# Altium project PCB_Project.PrjPcb (part 1 of 2)
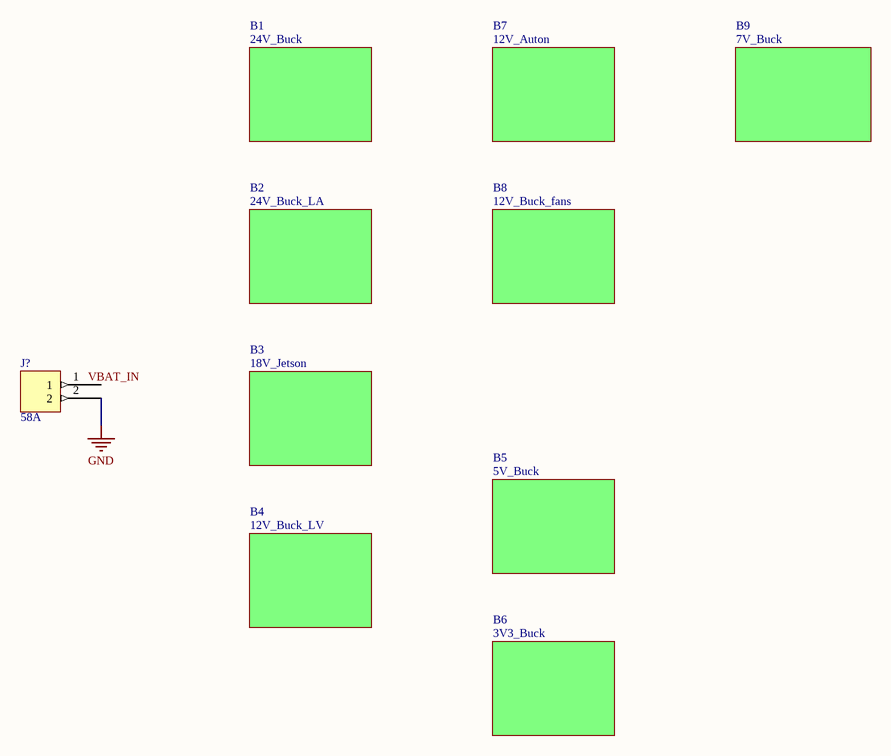
[diagram p0: pdb26.SchDoc]
9 sheets, 286 parts. Net scope: flat (ports and power ports of the same name join across sheets).
Sheets:
  pdb26.SchDoc
    B2 = 24V_Buck_LA.SchDoc
    B3 = 18V_Jetson.SchDoc
    B5 = 5V_Buck.SchDoc
    B6 = 3V3_Buck.SchDoc
    B7 = 12V_Auton.SchDoc
    B8 = 12V_Buck_fans.SchDoc
    B9 = 7V_Buck.SchDoc
  MCU.SchDoc

## Sheet pdb26.SchDoc
size A; SheetNumber: 1; SheetTotal: 9

### Parts
(Parts that share a designator on the sheet are numbered #1, #2 ... from top to bottom, then left to right.)
J?#1  Current Rating: 58A  [CONN-2PIN-0001]  (hidden comment: *691256610002)

### Sub-sheets
B1 = 24V_Buck (file not in this document): no entries
B2 = 24V_Buck_LA: no entries
B3 = 18V_Jetson: no entries
B4 = 12V_Buck_LV (file not in this document): no entries
B5 = 5V_Buck: no entries
B6 = 3V3_Buck: no entries
B7 = 12V_Auton: no entries
B8 = 12V_Buck_fans: no entries
B9 = 7V_Buck: no entries

### Nets
GND: J?#1.2

Not connected (* = marked no-connect by the designer): J?#1 1

### Notes on the sheet
- Labels drawn without touching a wire or pin: VBAT_IN

### Library data of the parts
J?#1 = CONN-2PIN-0001: 2 Position Wire to Board Terminal Block Horizontal with Board 0.400" (10.16mm) Through Hole; Number of Inputs: 2

## Sheet 24V_Buck_LA.SchDoc
size A; SheetNumber: 3; SheetTotal: 15
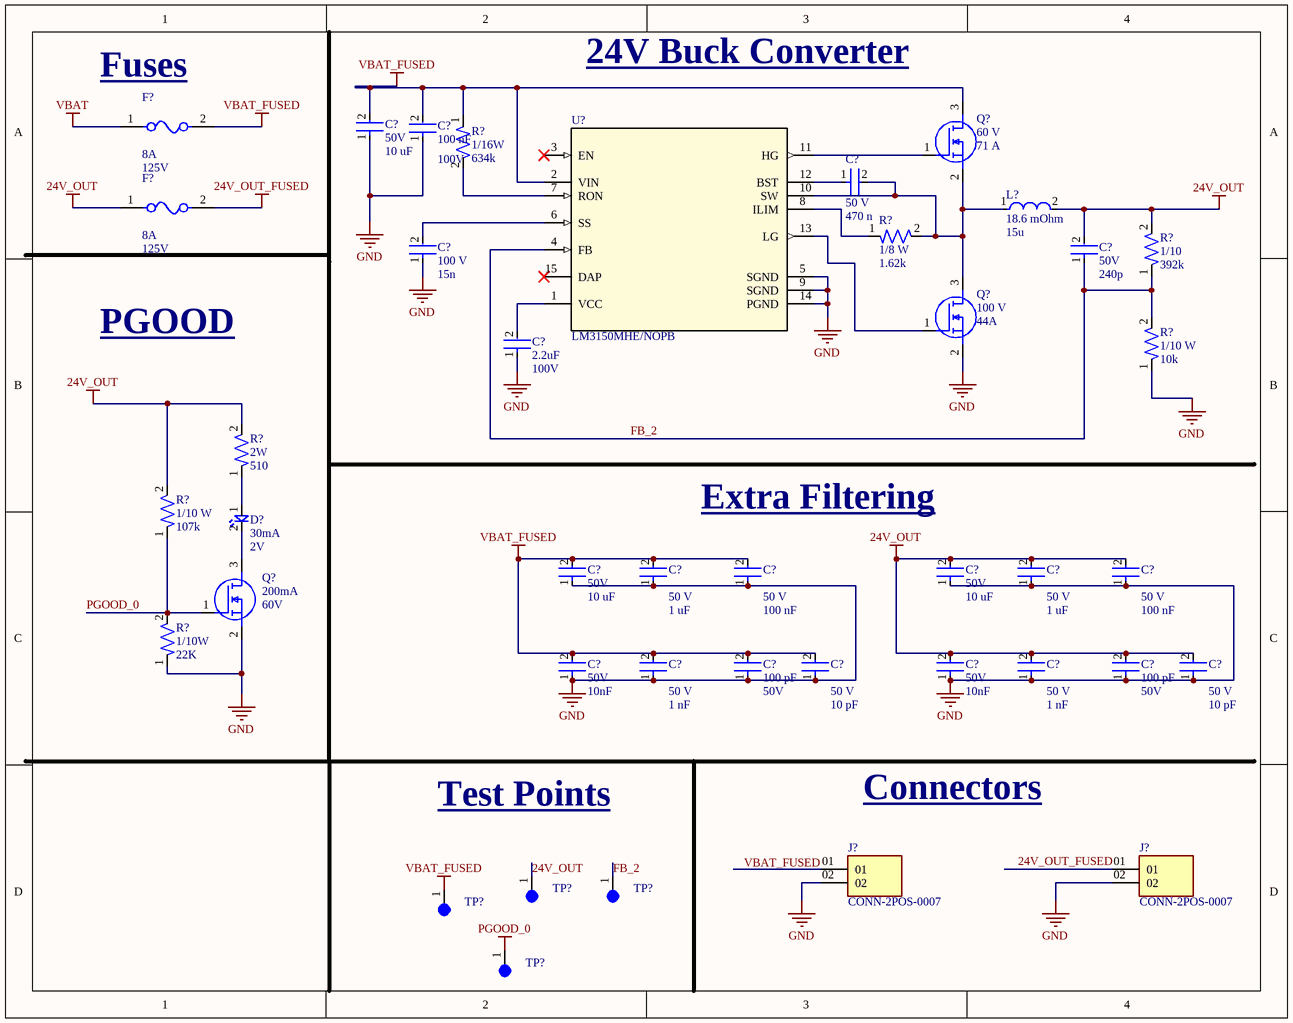
[diagram p1: 24V_Buck_LA.SchDoc]

### Parts
(Parts that share a designator on the sheet are numbered #1, #2 ... from top to bottom, then left to right.)
C?#1  Capacitance: 100 nF  Voltage: 100V  [CAP-0603]  (hidden comment: GMC10X7S104K100NT)
C?#2  Voltage: 50V  Capacitance: 10 uF  [CAP-1210]  (hidden comment: CL32B106KBJNNNE)
C?#3  Voltage: 50 V  Capacitance: 470 n  [CAP-0805]  (hidden comment: CC0805ZRY5V9BB474)
C?#4  Voltage: 100 V  Capacitance: 15n  [CAP-0805]  (hidden comment: CC0805KRX7R0BB153)
C?#5  Voltage: 50V  Capacitance: 240p  [CAP-0402]  (hidden comment: CC0402FRNPO9BN241)
C?#6  Capacitance: 2.2uF  Voltage: 100V  [CAP-1206]  (hidden comment: CC1206KKX7R0BB225)
C?#7  Voltage: 50 V  Capacitance: 1 uF  [CAP-0805]  (hidden comment: CC0805KKX7R9BB105)
C?#8  Voltage: 50 V  Capacitance: 100 nF  [CAP-0805]  (hidden comment: CC0805KRX7R9BB104)
C?#9  Voltage: 50 V  Capacitance: 1 uF  [CAP-0805]  (hidden comment: CC0805KKX7R9BB105)
C?#10  Voltage: 50 V  Capacitance: 100 nF  [CAP-0805]  (hidden comment: CC0805KRX7R9BB104)
C?#11  Voltage: 50V  Capacitance: 10 uF  [CAP-1210]  (hidden comment: CL32B106KBJNNNE)
C?#12  Voltage: 50V  Capacitance: 10 uF  [CAP-1210]  (hidden comment: CL32B106KBJNNNE)
C?#13  Voltage: 50 V  Capacitance: 1 nF  [CAP-0402]  (hidden comment: CC0402KRX7R9BB102)
C?#14  Voltage: 50 V  Capacitance: 10 pF  [CAP-0402]  (hidden comment: CC0402JRNPO9BN100)
C?#15  Voltage: 50 V  Capacitance: 1 nF  [CAP-0402]  (hidden comment: CC0402KRX7R9BB102)
C?#16  Voltage: 50 V  Capacitance: 10 pF  [CAP-0402]  (hidden comment: CC0402JRNPO9BN100)
C?#17  Voltage: 50V  Capacitance: 10nF  [CAP-0805]  (hidden comment: GRM2195C1H103JA01D)
C?#18  Capacitance: 100 pF  Voltage: 50V  [CAP-0402]  (hidden comment: CC0402JRNPO9BN101)
C?#19  Voltage: 50V  Capacitance: 10nF  [CAP-0805]  (hidden comment: GRM2195C1H103JA01D)
C?#20  Capacitance: 100 pF  Voltage: 50V  [CAP-0402]  (hidden comment: CC0402JRNPO9BN101)
D?  Forward Current: 30mA  Forward Voltage: 2V  [LED-0603]  (hidden comment: BL-HKC36G-AV-TRB)
F?#1  Fuse Current: 8A  Voltage Rating: 125V  [FUSE-0001]  (hidden comment: 01550900M)
F?#2  Fuse Current: 8A  Voltage Rating: 125V  [FUSE-0001]  (hidden comment: 01550900M)
J?#2  CONN-2POS-0007  [SAMTEC_HFWJ-02-02-T-S]
J?#3  CONN-2POS-0007  [SAMTEC_HFWJ-02-02-T-S]
L?#1  Resistance: 18.6 mOhm  Inductor: 15u  [IND_XAL1010_COC]  (hidden comment: XAL1010-153MED)
Q?#1  Max Voltage: 60 V  Max Current: 71 A  [NTMFS5C670NLT1G_ONS]  (hidden comment: NTMFS5C670NLT1G)
Q?#2  Voltage Max: 100 V  Current Max: 44A  [TRANS_CSD19534Q5A]  (hidden comment: CSD19534Q5A)
Q?#3  Continuous Current: 200mA  Voltage: 60V  [IC-SOT23-3]  (hidden comment: T2N7002AK,LM)
R?#1  Power: 1/16W  Resistance: 634k  [RES-0603]  (hidden comment: RC0402FR-07634KL)
R?#2  Power: 1/8 W  Resistance: 1.62k  [RES-0805]  (hidden comment: RC0805FR-071K62L)
R?#3  Power: 1/10  Resistance: 392k  [RES-0603]  (hidden comment: RC0603FR-07392KL)
R?#4  Power: 1/10 W  Resistance: 10k  [CAP-0603]  (hidden comment: RC0603FR-0710KL)
R?#5  Power: 2W  Resistance: 510  [RES-2512]  (hidden comment: RC2512JK-7W510RL)
R?#6  Power: 1/10 W  Resistance: 107k  [RES-0603]  (hidden comment: RC0603FR-07107KL)
R?#7  Power: 1/10W  Resistance: 22K  [RES-0603]  (hidden comment: RC0603FR-0722KL)
TP?#1  5003  [TEST-POINT-0001]  (value not drawn)
TP?#2  5003  [TEST-POINT-0001]  (value not drawn)
TP?#3  5003  [TEST-POINT-0001]  (value not drawn)
TP?#4  5003  [TEST-POINT-0001]  (value not drawn)
U?#1  LM3150MHE/NOPB  [MXA14A]

### Nets
24V_OUT: C?#5.2 C?#9.2 C?#10.2 C?#12.2 C?#15.2 C?#16.2 C?#19.2 C?#20.2 F?#2.1 L?#1.2 R?#3.2 R?#5.2 R?#6.2 TP?#1.1
24V_OUT_FUSED: F?#2.2 J?#3.01
GND: C?#1.1 C?#2.1 C?#4.1 C?#6.1 C?#7.1 C?#8.1 C?#9.1 C?#10.1 C?#11.1 C?#12.1 C?#13.1 C?#14.1 C?#15.1 C?#16.1 C?#17.1 C?#18.1 C?#19.1 C?#20.1 J?#2.02 J?#3.02 Q?#2.2(S) Q?#3.2(S) R?#4.1 R?#7.1 U?#1.5(SGND) U?#1.9(SGND) U?#1.14(PGND)
PGOOD_0: Q?#3.1(G) R?#6.1 R?#7.2 TP?#4.1
VBAT: F?#1.1
VBAT_FUSED: C?#1.2 C?#2.2 C?#7.2 C?#8.2 C?#11.2 C?#13.2 C?#14.2 C?#17.2 C?#18.2 F?#1.2 Q?#1.3(D) R?#1.1 TP?#3.1 U?#1.2(VIN)
FB_2: C?#5.1 R?#3.1 R?#4.2 TP?#2.1 U?#1.4(FB)
NetC?#3_1: C?#3.1 U?#1.12(BST)
NetC?#3_2: C?#3.2 L?#1.1 Q?#1.2(S) Q?#2.3(D) R?#2.2 U?#1.10(SW)
NetC?#4_2: C?#4.2 U?#1.6(SS)
NetC?#6_2: C?#6.2 U?#1.1(VCC)
NetD?_1: D?.1 R?#5.1
NetD?_2: D?.2 Q?#3.3(D)
NetQ?#1_1: Q?#1.1(G) U?#1.11(HG)
NetQ?#2_1: Q?#2.1(G) U?#1.13(LG)
NetR?#1_2: R?#1.2 U?#1.7(RON)
NetR?#2_1: R?#2.1 U?#1.8(ILIM)

Not connected (* = marked no-connect by the designer): J?#2 01; U?#1 3(EN)* 15(DAP)*

### Notes on the sheet
- (near F?#1) Fuses
- (near Q?#1) 24V Buck Converter
- PGOOD
- (near C?#8) Extra Filtering
- Test Points
- Connectors
- Labels drawn without touching a wire or pin: VBAT_FUSED

### Library data of the parts
C?#1 = CAP-100N-0001: 0.1 µF ±10% 100V Ceramic Capacitor X7S 0603 (1608 Metric)
C?#2 C?#11 C?#12 = CAP-10U-0002: CAP CER 10UF 50V X7R 1210; Device Class: Ceramic; Size: 1210; ComponentLink1Description: Datasheet; ComponentLink1URL: https://mm.digikey.com/Volume0/opasdata/d220001/medias/docus/41/CL32B106KBJNNNE_Spec.pdf
C?#3 = CAP-470N-0002: 0.47 µF -20%, +80% 50V Ceramic Capacitor Y5V (F) 0805 (2012 Metric)
C?#4 = CAP-15N-0001: 0.015 µF ±10% 100V Ceramic Capacitor X7R 0805 (2012 Metric)
C?#5 = CAP-240P-0001: 240 pF ±1% 50V Ceramic Capacitor C0G, NP0 0402 (1005 Metric)
C?#6 = CAP-2.2U-0001: CAP CER 2.2UF 100V X7R 1206; Device Class: Ceramic; Size: 1206; ComponentLink1Description: Datasheet; ComponentLink1URL: https://www.yageo.com/upload/media/product/productsearch/datasheet/mlcc/UPY-GPHC_X7R_6.3V-to-250V_24.pdf
C?#7 C?#9 = CAP-1U-0001: 1 µF ±10% 50V Ceramic Capacitor X7R 0805 (2012 Metric)
C?#8 C?#10 = CAP-100N-0002: 0.1 µF ±10% 50V Ceramic Capacitor X7R 0805 (2012 Metric)
C?#13 C?#15 = CAP-1N-0001: 1000 pF ±10% 50V Ceramic Capacitor X7R 0402 (1005 Metric)
C?#14 C?#16 = CAP-10P-0001: 10 pF ±5% 50V Ceramic Capacitor C0G, NP0 0402 (1005 Metric)
C?#17 C?#19 = CAP-10N-0001: CAP CER 10000PF 50V C0G/NP0 0805; Device Class: Ceramic; Size: 0805; ComponentLink1Description: Datasheet; ComponentLink1URL: https://search.murata.co.jp/Ceramy/image/img/A01X/G101/ENG/GRM2195C1H103JA01-01.pdf
C?#18 C?#20 = CAP-100P-0001: CAP CER 100PF 50V C0G/NPO 0402; Device Class: Ceramic; Size: 0402; ComponentLink1Description: Datasheet; ComponentLink1URL: https://www.yageo.com/upload/media/product/productsearch/datasheet/mlcc/UPY-GP_NP0_16V-to-50V_18.pdf
D? = LED-0001: LED YELLOW CLEAR 0603 SMD; ComponentLink1Description: Datasheet; ComponentLink1URL: https://www.americanbrightled.com/pdffiles/led-components/smt/BL-HKC36G-AV-TRB.pdf
F?#1 F?#2 = FUSE-0001: FUSE BLOK CARTRIDGE 125V 10A SMD; ComponentLink2Description: Datasheet; ComponentLink2URL: https://www.littelfuse.com/~/media/electronics/datasheets/fuses/littelfuse_fuse_154_154t_154l_154tl_datasheet.pdf.pdf
J?#2 J?#3 = CONN-2POS-0007: Conn Unshrouded Header HDR 2 POS 3.96mm Solder ST Thru-Hole Bulk; MF: Samtec; MP: HFWJ-02-02-T-S; SnapEDA_Link: https://www.snapeda.com/parts/HFWJ-02-02-T-S/Samtec/view-part/?ref=snap; Package: None; Value: *; Check_prices: https://www.snapeda.com/parts/HFWJ-02-02-T-S/Samtec/view-part/?ref=eda
L?#1 = IND-15u-0001: 15 µH Shielded Molded Inductor 9.9 A 18.6mOhm Max Nonstandard; Manufacturer_Name: Coilcraft; Copyright: Copyright (C) 2025 Ultra Librarian. All rights reserved.; Manufacturer_Part_Number: XAL1010-153MED
Q?#1 = NMOS-71A-0001: N-Channel 60 V 17A (Ta), 71A (Tc) 3.6W (Ta), 61W (Tc) Surface Mount 5-DFN (5x6) (8-SOFL); Manufacturer_Name: onsemi; Copyright: Copyright (C) 2025 Ultra Librarian. All rights reserved.; Manufacturer_Part_Number: NTMFS5C670NLT1G; RefDes: RefDes; Type: Type
Q?#2 = NMOS-44A-0001: N-Channel 100 V 44A (Tc) 3.2W (Ta), 63W (Tc) Surface Mount 8-VSONP (5x6); MF: Texas Instruments; Mouser-Purchase-URL: https://snapeda.com/shop?store=Mouser&id=485742; Package: VSONP-8 Texas Instruments; Texas_Instruments-Purchase-URL: https://snapeda.com/shop?store=Texas+Instruments&id=485742; Value: *; Price: None; DigiKey-Purchase-URL: https://snapeda.com/shop?store=DigiKey&id=485742; MP: CSD19534Q5A; SnapEDA_Link: https://www.snapeda.com/parts/CSD19534Q5A/Texas%20Instruments/view-part/485742/?ref=snap; Availability: Good
Q?#3 = NMOS-200MA-0001: MOSFET N-CH 60V 200MA SOT23; ComponentLink1Description: Datasheet; ComponentLink1URL: https://toshiba.semicon-storage.com/info/T2N7002AK_datasheet_en_20150401.pdf?did=29712&prodName=T2N7002AK
R?#1 = RES-634k-0001: RES 634K OHM 1% 1/16W 0402; Tolerance: 1%; Size: 0603; ComponentLink1Description: Datasheet; ComponentLink1URL: https://www.yageo.com/upload/media/product/products/datasheet/rchip/PYu-RC_Group_51_RoHS_L_12.pdf
R?#2 = RES-1.62k-001: 1.62 kOhms ±1% 0.125W, 1/8W Chip Resistor 0805 (2012 Metric) Moisture Resistant Thick Film
R?#3 = RES-392k-0001: 392 kOhms ±1% 0.1W, 1/10W Chip Resistor 0603 (1608 Metric) Moisture Resistant Thick Film
R?#4 = RES-10k-0002: 10 kOhms ±1% 0.1W, 1/10W Chip Resistor 0603 (1608 Metric) Moisture Resistant Thick Film
R?#5 = RES-510-0001: 510 Ohms ±5% 2W Chip Resistor 2512 (6332 Metric) Moisture Resistant Thick Film
R?#6 = RES-107k-0001: 107 kOhms ±1% 0.1W, 1/10W Chip Resistor 0603 (1608 Metric) Moisture Resistant Thick Film
R?#7 = RES-22k-0001: 22 kOhms ±1% 0.1W, 1/10W Chip Resistor 0603 (1608 Metric) Moisture Resistant Thick Film; Parameter 1: *
TP?#1-TP?#4 = TEST-POINT-0001: Oranange PC Test Point, Miniature Phoisphor Bronze Silver Plating Through Hole Mounting Type
U?#1 = IC-BUCK-0001: Buck Regulator Positive Output Step-Down DC-DC Controller IC 14-HTSSOP; Manufacturer_Name: Texas Instruments; Copyright: Copyright (C) 2025 Ultra Librarian. All rights reserved.; Manufacturer_Part_Number: LM3150MHE/NOPB; Datasheet: https://www.ti.com/lit/gpn/lm3150; RefDes: RefDes; Type: Type

## Sheet 18V_Jetson.SchDoc
size A; SheetNumber: 4; SheetTotal: 17
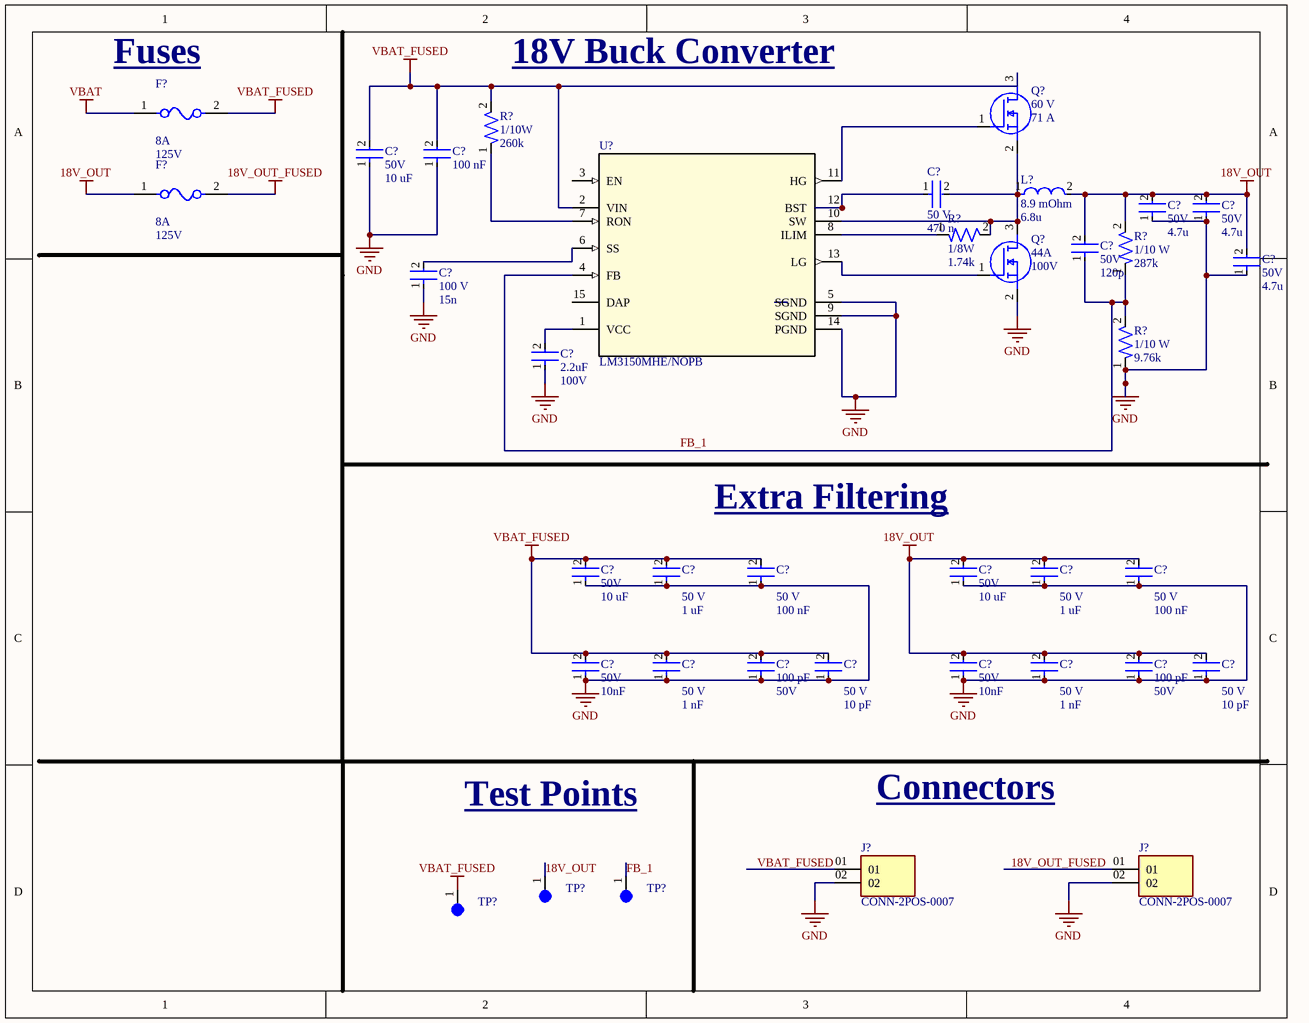
[diagram p2: 18V_Jetson.SchDoc]

### Parts
(Parts that share a designator on the sheet are numbered #1, #2 ... from top to bottom, then left to right.)
C?#21  Capacitance: 100 nF  [CAP-0603]  (hidden comment: GMC10X7S104K100NT)
C?#22  Voltage: 50V  Capacitance: 10 uF  [CAP-1210]  (hidden comment: CL32B106KBJNNNE)
C?#23  Voltage: 50 V  Capacitance: 470 n  [CAP-0805]  (hidden comment: CC0805ZRY5V9BB474)
C?#24  Voltage: 50V  Capacitance: 4.7u  [CAP-1210]  (hidden comment: CC1210KFX7R9BB475)
C?#25  Voltage: 50V  Capacitance: 4.7u  [CAP-1210]  (hidden comment: CC1210KFX7R9BB475)
C?#26  Voltage: 50V  Capacitance: 120p  [CAP-0402]  (hidden comment: CC0402JPNPO9BN121)
C?#27  Voltage: 50V  Capacitance: 4.7u  [CAP-1210]  (hidden comment: CC1210KFX7R9BB475)
C?#28  Voltage: 100 V  Capacitance: 15n  [CAP-0805]  (hidden comment: CC0805KRX7R0BB153)
C?#29  Capacitance: 2.2uF  Voltage: 100V  [CAP-1206]  (hidden comment: CC1206KKX7R0BB225)
C?#30  Voltage: 50 V  Capacitance: 1 uF  [CAP-0805]  (hidden comment: CC0805KKX7R9BB105)
C?#31  Voltage: 50 V  Capacitance: 100 nF  [CAP-0805]  (hidden comment: CC0805KRX7R9BB104)
C?#32  Voltage: 50 V  Capacitance: 1 uF  [CAP-0805]  (hidden comment: CC0805KKX7R9BB105)
C?#33  Voltage: 50 V  Capacitance: 100 nF  [CAP-0805]  (hidden comment: CC0805KRX7R9BB104)
C?#34  Voltage: 50V  Capacitance: 10 uF  [CAP-1210]  (hidden comment: CL32B106KBJNNNE)
C?#35  Voltage: 50V  Capacitance: 10 uF  [CAP-1210]  (hidden comment: CL32B106KBJNNNE)
C?#36  Voltage: 50 V  Capacitance: 1 nF  [CAP-0402]  (hidden comment: CC0402KRX7R9BB102)
C?#37  Voltage: 50 V  Capacitance: 10 pF  [CAP-0402]  (hidden comment: CC0402JRNPO9BN100)
C?#38  Voltage: 50 V  Capacitance: 1 nF  [CAP-0402]  (hidden comment: CC0402KRX7R9BB102)
C?#39  Voltage: 50 V  Capacitance: 10 pF  [CAP-0402]  (hidden comment: CC0402JRNPO9BN100)
C?#40  Voltage: 50V  Capacitance: 10nF  [CAP-0805]  (hidden comment: GRM2195C1H103JA01D)
C?#41  Capacitance: 100 pF  Voltage: 50V  [CAP-0402]  (hidden comment: CC0402JRNPO9BN101)
C?#42  Voltage: 50V  Capacitance: 10nF  [CAP-0805]  (hidden comment: GRM2195C1H103JA01D)
C?#43  Capacitance: 100 pF  Voltage: 50V  [CAP-0402]  (hidden comment: CC0402JRNPO9BN101)
F?#3  Fuse Current: 8A  Voltage Rating: 125V  [FUSE-0001]  (hidden comment: 01550900M)
F?#4  Fuse Current: 8A  Voltage Rating: 125V  [FUSE-0001]  (hidden comment: 01550900M)
J?#4  CONN-2POS-0007  [SAMTEC_HFWJ-02-02-T-S]
J?#5  CONN-2POS-0007  [SAMTEC_HFWJ-02-02-T-S]
L?#2  Resistance: 8.9 mOhm  Inductance: 6.8u  (hidden comment: XAL1010-682MED)
Q?#4  Max Voltage: 60 V  Max Current: 71 A  [NTMFS5C670NLT1G_ONS]  (hidden comment: NTMFS5C670NLT1G)
Q?#5  Current: 44A  Vdss: 100V  [TRANS_CSD19534Q5A]  (hidden comment: CSD19534Q5A)
R?#8  Power: 1/10W  Resistance: 260k  [RES-0402]  (hidden comment: ERJ-2RKF2743X)
R?#9  Power: 1/8W  Resistance: 1.74k  [RES-0805]  (hidden comment: RC0805FR-071K74L)
R?#10  Power: 1/10 W  Resistance: 287k  (hidden comment: RC0603FR-07287KL)
R?#11  Power: 1/10 W  Resistance: 9.76k  [RES-0603]  (hidden comment: RC0603FR-079K76L)
TP?#5  5003  [TEST-POINT-0001]  (value not drawn)
TP?#6  5003  [TEST-POINT-0001]  (value not drawn)
TP?#7  5003  [TEST-POINT-0001]  (value not drawn)
U?#2  LM3150MHE/NOPB  [MXA14A]

### Nets
18V_OUT: C?#24.2 C?#25.2 C?#26.2 C?#27.2 C?#32.2 C?#33.2 C?#35.2 C?#38.2 C?#39.2 C?#42.2 C?#43.2 F?#4.1 L?#2.2 R?#10.2 TP?#5.1
18V_OUT_FUSED: F?#4.2
GND: C?#21.1 C?#22.1 C?#24.1 C?#25.1 C?#27.1 C?#28.1 C?#29.1 C?#30.1 C?#31.1 C?#32.1 C?#33.1 C?#34.1 C?#35.1 C?#36.1 C?#37.1 C?#38.1 C?#39.1 C?#40.1 C?#41.1 C?#42.1 C?#43.1 J?#4.02 J?#5.02 Q?#5.2(S) R?#11.1 U?#2.5(SGND) U?#2.9(SGND) U?#2.14(PGND)
VBAT: F?#3.1
VBAT_FUSED: C?#21.2 C?#22.2 C?#30.2 C?#31.2 C?#34.2 C?#36.2 C?#37.2 C?#40.2 C?#41.2 F?#3.2 Q?#4.3(D) R?#8.2 TP?#7.1 U?#2.2(VIN)
FB_1: C?#26.1 R?#10.1 R?#11.2 TP?#6.1 U?#2.4(FB)
NetC?#23_1: C?#23.1 U?#2.12(BST)
NetC?#23_2: C?#23.2 L?#2.1 Q?#4.2(S) Q?#5.3(D) R?#9.2 U?#2.10(SW)
NetC?#28_2: C?#28.2 U?#2.6(SS)
NetC?#29_2: C?#29.2 U?#2.1(VCC)
NetQ?#4_1: Q?#4.1(G) U?#2.11(HG)
NetQ?#5_1: Q?#5.1(G) U?#2.13(LG)
NetR?#8_1: R?#8.1 U?#2.7(RON)
NetR?#9_1: R?#9.1 U?#2.8(ILIM)

Not connected (* = marked no-connect by the designer): J?#4 01; J?#5 01; U?#2 3(EN) 15(DAP)

### Notes on the sheet
- (near F?#3) Fuses
- (near R?#8) 18V Buck Converter
- (near C?#31) Extra Filtering
- Test Points
- Connectors
- Labels drawn without touching a wire or pin: 18V_OUT_FUSED, VBAT_FUSED

### Library data of the parts
C?#21 = CAP-100N-0001: as C?#1 on sheet 24V_Buck_LA
C?#22 C?#34 C?#35 = CAP-10U-0002: CAP CER 10UF 50V X7R 1210; Device Class: Ceramic; Size: 1210; ComponentLink1Description: Datasheet; ComponentLink1URL: https://mm.digikey.com/Volume0/opasdata/d220001/medias/docus/41/CL32B106KBJNNNE_Spec.pdf
C?#23 = CAP-470N-0002: as C?#3 on sheet 24V_Buck_LA
C?#24 C?#25 C?#27 = CAP-4.7U-0003: 4.7 µF ±10% 50V Ceramic Capacitor X7R 1210 (3225 Metric)
C?#26 = CAP-120p-0001: CAP CER 120PF 50V C0G/NPO 0402
C?#28 = CAP-15N-0001: as C?#4 on sheet 24V_Buck_LA
C?#29 = CAP-2.2U-0001: CAP CER 2.2UF 100V X7R 1206; Device Class: Ceramic; Size: 1206; ComponentLink1Description: Datasheet; ComponentLink1URL: https://www.yageo.com/upload/media/product/productsearch/datasheet/mlcc/UPY-GPHC_X7R_6.3V-to-250V_24.pdf
C?#30 C?#32 = CAP-1U-0001: as C?#7 on sheet 24V_Buck_LA
C?#31 C?#33 = CAP-100N-0002: as C?#8 on sheet 24V_Buck_LA
C?#36 C?#38 = CAP-1N-0001: as C?#13 on sheet 24V_Buck_LA
C?#37 C?#39 = CAP-10P-0001: as C?#14 on sheet 24V_Buck_LA
C?#40 C?#42 = CAP-10N-0001: CAP CER 10000PF 50V C0G/NP0 0805; Device Class: Ceramic; Size: 0805; ComponentLink1Description: Datasheet; ComponentLink1URL: https://search.murata.co.jp/Ceramy/image/img/A01X/G101/ENG/GRM2195C1H103JA01-01.pdf
C?#41 C?#43 = CAP-100P-0001: CAP CER 100PF 50V C0G/NPO 0402; Device Class: Ceramic; Size: 0402; ComponentLink1Description: Datasheet; ComponentLink1URL: https://www.yageo.com/upload/media/product/productsearch/datasheet/mlcc/UPY-GP_NP0_16V-to-50V_18.pdf
F?#3 F?#4 = FUSE-0001: FUSE BLOK CARTRIDGE 125V 10A SMD; ComponentLink2Description: Datasheet; ComponentLink2URL: https://www.littelfuse.com/~/media/electronics/datasheets/fuses/littelfuse_fuse_154_154t_154l_154tl_datasheet.pdf.pdf
J?#4 J?#5 = CONN-2POS-0007: as J?#2 on sheet 24V_Buck_LA; SnapEDA_Link: https://www.snapeda.com/parts/HFWJ-02-02-T-S/Samtec/view-part/?ref=snap; Package: None; Value: *; Check_prices: https://www.snapeda.com/parts/HFWJ-02-02-T-S/Samtec/view-part/?ref=eda
L?#2 = IND-6.8u-0001: 6.8 µH Shielded Molded Inductor 14 A 8.9mOhm Max Nonstandard
Q?#4 = NMOS-71A-0001: as Q?#1 on sheet 24V_Buck_LA; Copyright: Copyright (C) 2025 Ultra Librarian. All rights reserved.; Manufacturer_Part_Number: NTMFS5C670NLT1G; RefDes: RefDes; Type: Type
Q?#5 = MOS-44A-0001: 100V, N ch NexFET MOSFET, single SON5x6, 15.1mOhm 8-VSONP -55 to 150; MF: Texas Instruments; Vth: 3.4V; Mouser-Purchase-URL: https://snapeda.com/shop?store=Mouser&id=485742; Package: VSONP-8 Texas Instruments; Texas_Instruments-Purchase-URL: https://snapeda.com/shop?store=Texas+Instruments&id=485742; Value: *; Price: None; DigiKey-Purchase-URL: https://snapeda.com/shop?store=DigiKey&id=485742; MP: CSD19534Q5A; SnapEDA_Link: https://www.snapeda.com/parts/CSD19534Q5A/Texas%20Instruments/view-part/485742/?ref=snap; Availability: Good
R?#8 = RES-260k-0001: RES SMD 274K OHM 1% 1/10W 0402
R?#9 = RES-1.74k-0001: RES 1.74K OHM 1% 1/8W 0805
R?#10 = RES-287k-0001: RES 287K OHM 1% 1/10W 0603
R?#11 = RES-9.76k-0001: RES 9.76K OHM 1% 1/10W 0603
TP?#5-TP?#7 = TEST-POINT-0001: as TP?#1 on sheet 24V_Buck_LA
U?#2 = IC-BUCK_0011: 6V to 42V Synchronous Step-Down Controller with Adjustable Output Voltage 14-HTSSOP -40 to 125; Manufacturer_Name: Texas Instruments; Copyright: Copyright (C) 2025 Ultra Librarian. All rights reserved.; Manufacturer_Part_Number: LM3150MHE/NOPB; Datasheet: https://www.ti.com/lit/gpn/lm3150; RefDes: RefDes; Type: Type

## Sheet 5V_Buck.SchDoc
size A; SheetNumber: 7; SheetTotal: 16
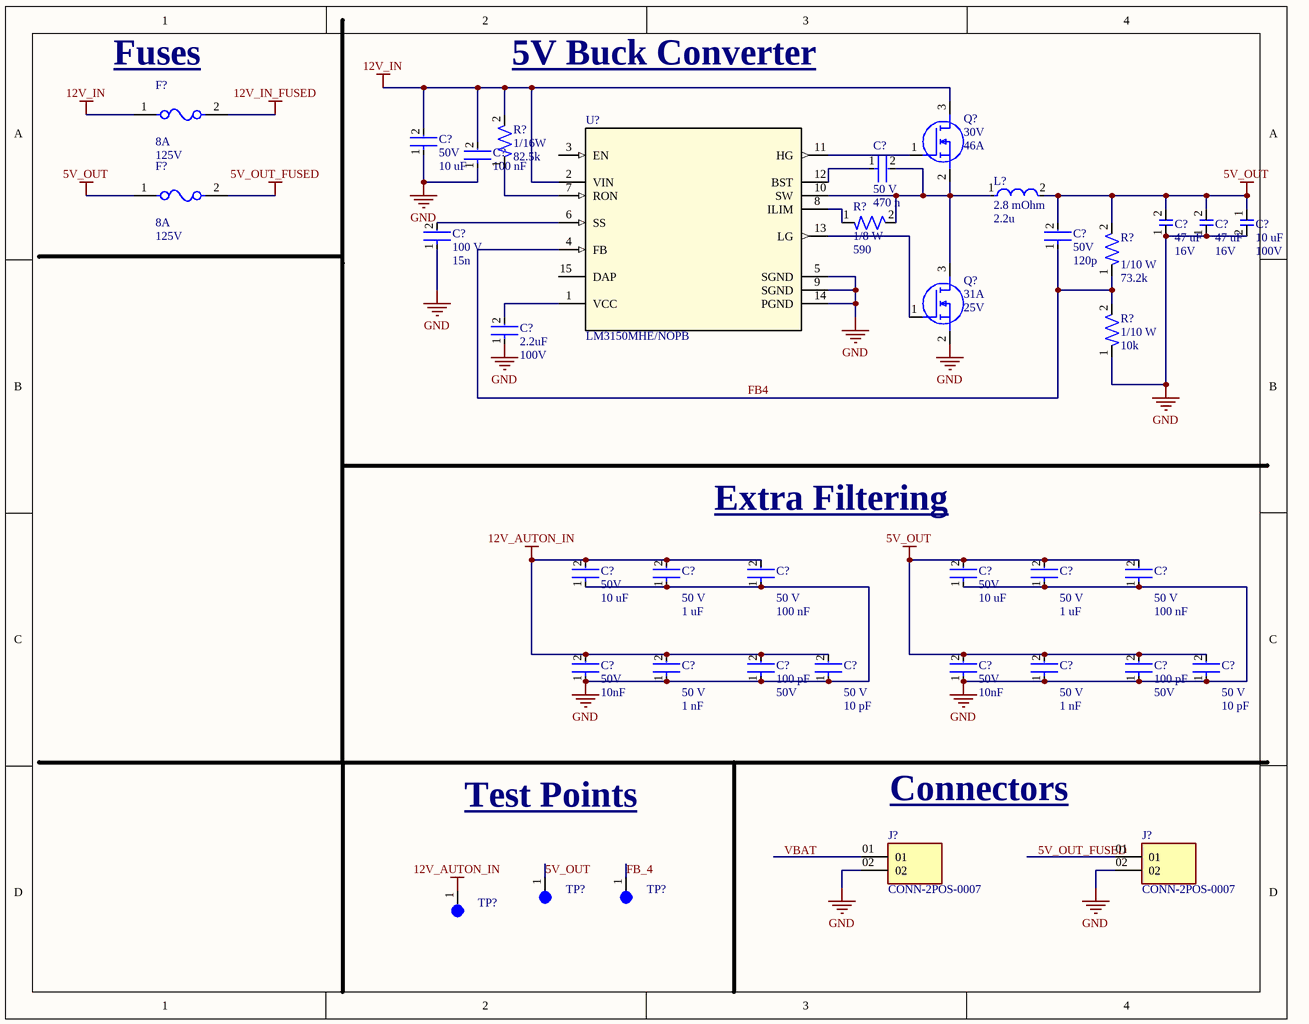
[diagram p3: 5V_Buck.SchDoc]

### Parts
(Parts that share a designator on the sheet are numbered #1, #2 ... from top to bottom, then left to right.)
C?#44  Voltage: 50V  Capacitance: 10 uF  [CAP-1210]  (hidden comment: CL32B106KBJNNNE)
C?#45  Capacitance: 100 nF  [CAP-0603]  (hidden comment: GMC10X7S104K100NT)
C?#46  Voltage: 50 V  Capacitance: 470 n  [CAP-0805]  (hidden comment: CC0805ZRY5V9BB474)
C?#47  Capacitance: 47 uF  Voltage: 16V  [CAP-1210]  (hidden comment: GRM32ER61C476KE15L)
C?#48  Capacitance: 47 uF  Voltage: 16V  [CAP-1210]  (hidden comment: GRM32ER61C476KE15L)
C?#49  Capcitance: 10 uF  Voltage Rating: 100V  [CAP-1210]  (hidden comment: GRM32EC72A106KE05L)
C?#50  Voltage: 100 V  Capacitance: 15n  [CAP-0805]  (hidden comment: CC0805KRX7R0BB153)
C?#51  Voltage: 50V  Capacitance: 120p  [CAP-0402]  (hidden comment: CC0402JPNPO9BN121)
C?#52  Capacitance: 2.2uF  Voltage: 100V  [CAP-1206]  (hidden comment: CC1206KKX7R0BB225)
C?#53  Voltage: 50 V  Capacitance: 1 uF  [CAP-0805]  (hidden comment: CC0805KKX7R9BB105)
C?#54  Voltage: 50 V  Capacitance: 100 nF  [CAP-0805]  (hidden comment: CC0805KRX7R9BB104)
C?#55  Voltage: 50 V  Capacitance: 1 uF  [CAP-0805]  (hidden comment: CC0805KKX7R9BB105)
C?#56  Voltage: 50 V  Capacitance: 100 nF  [CAP-0805]  (hidden comment: CC0805KRX7R9BB104)
C?#57  Voltage: 50V  Capacitance: 10 uF  [CAP-1210]  (hidden comment: CL32B106KBJNNNE)
C?#58  Voltage: 50V  Capacitance: 10 uF  [CAP-1210]  (hidden comment: CL32B106KBJNNNE)
C?#59  Voltage: 50 V  Capacitance: 1 nF  [CAP-0402]  (hidden comment: CC0402KRX7R9BB102)
C?#60  Voltage: 50 V  Capacitance: 10 pF  [CAP-0402]  (hidden comment: CC0402JRNPO9BN100)
C?#61  Voltage: 50 V  Capacitance: 1 nF  [CAP-0402]  (hidden comment: CC0402KRX7R9BB102)
C?#62  Voltage: 50 V  Capacitance: 10 pF  [CAP-0402]  (hidden comment: CC0402JRNPO9BN100)
C?#63  Voltage: 50V  Capacitance: 10nF  [CAP-0805]  (hidden comment: GRM2195C1H103JA01D)
C?#64  Capacitance: 100 pF  Voltage: 50V  [CAP-0402]  (hidden comment: CC0402JRNPO9BN101)
C?#65  Voltage: 50V  Capacitance: 10nF  [CAP-0805]  (hidden comment: GRM2195C1H103JA01D)
C?#66  Capacitance: 100 pF  Voltage: 50V  [CAP-0402]  (hidden comment: CC0402JRNPO9BN101)
F?#5  Fuse Current: 8A  Voltage Rating: 125V  [FUSE-0001]  (hidden comment: 01550900M)
F?#6  Fuse Current: 8A  Voltage Rating: 125V  [FUSE-0001]  (hidden comment: 01550900M)
J?#6  CONN-2POS-0007  [SAMTEC_HFWJ-02-02-T-S]
J?#7  CONN-2POS-0007  [SAMTEC_HFWJ-02-02-T-S]
L?#3  Resistance: 2.8 mOhm  Inductance: 2.2u  [IND_XAL1010_COC]  (hidden comment: XAL1010-222MED)
Q?#6  Max Voltage: 30V  Max Current: 46A  [NTMFS5C670NLT1G_ONS - duplicate]  (hidden comment: NTMFS4C029NT1G)
Q?#7  Max Current: 31A  Max Voltage: 25V  (hidden comment: CSD16321Q5)
R?#12  Power: 1/16W  Resistance: 82.5k  [RES-0402]  (hidden comment: RC0402FR-0782K5L)
R?#13  Power: 1/8 W  Resistance: 590  (hidden comment: RC0805FR-07590RL)
R?#14  Power: 1/10 W  Resistance: 73.2k  [RES-0603]  (hidden comment: RC0603FR-0773K2L)
R?#15  Power: 1/10 W  Resistance: 10k  [CAP-0603]  (hidden comment: RC0603FR-0710KL)
TP?#8  5003  [TEST-POINT-0001]  (value not drawn)
TP?#9  5003  [TEST-POINT-0001]  (value not drawn)
TP?#10  5003  [TEST-POINT-0001]  (value not drawn)
U?#3  LM3150MHE/NOPB  [MXA14A]

### Nets
5V_OUT: C?#47.2 C?#48.2 C?#49.1 C?#51.2 C?#55.2 C?#56.2 C?#58.2 C?#61.2 C?#62.2 C?#65.2 C?#66.2 F?#6.1 L?#3.2 R?#14.2 TP?#8.1
5V_OUT_FUSED: F?#6.2
12V_AUTON_IN: C?#53.2 C?#54.2 C?#57.2 C?#59.2 C?#60.2 C?#63.2 C?#64.2 TP?#10.1
12V_IN: C?#44.2 C?#45.2 F?#5.1 Q?#6.3(D) R?#12.2 U?#3.2(VIN)
12V_IN_FUSED: F?#5.2
GND: C?#44.1 C?#45.1 C?#47.1 C?#48.1 C?#49.2 C?#50.1 C?#52.1 C?#53.1 C?#54.1 C?#55.1 C?#56.1 C?#57.1 C?#58.1 C?#59.1 C?#60.1 C?#61.1 C?#62.1 C?#63.1 C?#64.1 C?#65.1 C?#66.1 J?#6.02 J?#7.02 Q?#7.2(S) R?#15.1 U?#3.5(SGND) U?#3.9(SGND) U?#3.14(PGND)
FB4: C?#51.1 R?#14.1 R?#15.2 U?#3.4(FB)
FB_4: TP?#9.1
NetC?#46_1: C?#46.1 U?#3.12(BST)
NetC?#46_2: C?#46.2 L?#3.1 Q?#6.2(S) Q?#7.3(D) R?#13.2 U?#3.10(SW)
NetC?#50_2: C?#50.2 U?#3.6(SS)
NetC?#52_2: C?#52.2 U?#3.1(VCC)
NetQ?#6_1: Q?#6.1(G) U?#3.11(HG)
NetQ?#7_1: Q?#7.1(G) U?#3.13(LG)
NetR?#12_1: R?#12.1 U?#3.7(RON)
NetR?#13_1: R?#13.1 U?#3.8(ILIM)

Not connected (* = marked no-connect by the designer): J?#6 01; J?#7 01; U?#3 3(EN) 15(DAP)

### Notes on the sheet
- (near F?#5) Fuses
- 5V Buck Converter
- (near C?#54) Extra Filtering
- Test Points
- (near J?#6) Connectors
- Labels drawn without touching a wire or pin: 5V_OUT_FUSED, VBAT

### Library data of the parts
C?#44 C?#57 C?#58 = CAP-10U-0002: CAP CER 10UF 50V X7R 1210; Device Class: Ceramic; Size: 1210; ComponentLink1Description: Datasheet; ComponentLink1URL: https://mm.digikey.com/Volume0/opasdata/d220001/medias/docus/41/CL32B106KBJNNNE_Spec.pdf
C?#45 = CAP-100N-0001: as C?#1 on sheet 24V_Buck_LA
C?#46 = CAP-470N-0002: as C?#3 on sheet 24V_Buck_LA
C?#47 C?#48 = CAP-47U-0001: 47 µF ±10% 16V Ceramic Capacitor X5R 1210 (3225 Metric); Manufacturer: Murata Electronics; Tolerance: +/- 10%; Assembled?: no; Manufacturer Part Number: GRM32ER61C476KE15L; Package Size: 1210
C?#49 = CAP-10U-0003: 10 µF ±10% 100V Ceramic Capacitor X7S 1210 (3225 Metric); Package Size: 1210
C?#50 = CAP-15N-0001: as C?#4 on sheet 24V_Buck_LA
C?#51 = CAP-120p-0001: CAP CER 120PF 50V C0G/NPO 0402
C?#52 = CAP-2.2U-0001: CAP CER 2.2UF 100V X7R 1206; Device Class: Ceramic; Size: 1206; ComponentLink1Description: Datasheet; ComponentLink1URL: https://www.yageo.com/upload/media/product/productsearch/datasheet/mlcc/UPY-GPHC_X7R_6.3V-to-250V_24.pdf
C?#53 C?#55 = CAP-1U-0001: as C?#7 on sheet 24V_Buck_LA
C?#54 C?#56 = CAP-100N-0002: as C?#8 on sheet 24V_Buck_LA
C?#59 C?#61 = CAP-1N-0001: as C?#13 on sheet 24V_Buck_LA
C?#60 C?#62 = CAP-10P-0001: as C?#14 on sheet 24V_Buck_LA
C?#63 C?#65 = CAP-10N-0001: CAP CER 10000PF 50V C0G/NP0 0805; Device Class: Ceramic; Size: 0805; ComponentLink1Description: Datasheet; ComponentLink1URL: https://search.murata.co.jp/Ceramy/image/img/A01X/G101/ENG/GRM2195C1H103JA01-01.pdf
C?#64 C?#66 = CAP-100P-0001: CAP CER 100PF 50V C0G/NPO 0402; Device Class: Ceramic; Size: 0402; ComponentLink1Description: Datasheet; ComponentLink1URL: https://www.yageo.com/upload/media/product/productsearch/datasheet/mlcc/UPY-GP_NP0_16V-to-50V_18.pdf
F?#5 F?#6 = FUSE-0001: FUSE BLOK CARTRIDGE 125V 10A SMD; ComponentLink2Description: Datasheet; ComponentLink2URL: https://www.littelfuse.com/~/media/electronics/datasheets/fuses/littelfuse_fuse_154_154t_154l_154tl_datasheet.pdf.pdf
J?#6 J?#7 = CONN-2POS-0007: as J?#2 on sheet 24V_Buck_LA; SnapEDA_Link: https://www.snapeda.com/parts/HFWJ-02-02-T-S/Samtec/view-part/?ref=snap; Package: None; Value: *; Check_prices: https://www.snapeda.com/parts/HFWJ-02-02-T-S/Samtec/view-part/?ref=eda
L?#3 = IND-2.2u-0001: 2.2 µH Shielded Molded Inductor 24.5 A 2.8mOhm Max Nonstandard
Q?#6 = NMOS-46A-0001: N-Channel 30 V 15A (Ta), 46A (Tc) 2.49W (Ta), 23.6W (Tc) Surface Mount 5-DFN (5x6) (8-SOFL)
Q?#7 = NMOS-31A-0001: N-Channel 25 V 31A (Ta), 100A (Tc) 3.1W (Ta) Surface Mount 8-VSON-CLIP (5x6)
R?#12 = RES-82.5k-0001: 82.5 kOhms ±1% 0.063W, 1/16W Chip Resistor 0402 (1005 Metric) Moisture Resistant Thick Film; Tolerance: 1%; Size: 0603; ComponentLink1Description: Datasheet; ComponentLink1URL: https://www.lcsc.com/datasheet/lcsc_datasheet_2304140030_YAGEO-RC0603FR-0712KL_C114659.pdf
R?#13 = RES-590-0001: 590 Ohms ±1% 0.125W, 1/8W Chip Resistor 0805 (2012 Metric) Moisture Resistant Thick Film
R?#14 = RES-73.2k-0001: 73.2 kOhms ±1% 0.1W, 1/10W Chip Resistor 0603 (1608 Metric) Moisture Resistant Thick Film
R?#15 = RES-10k-0002: as R?#4 on sheet 24V_Buck_LA
TP?#8-TP?#10 = TEST-POINT-0001: as TP?#1 on sheet 24V_Buck_LA
U?#3 = IC-BUCK_0011: as U?#2 on sheet 18V_Jetson; Copyright: Copyright (C) 2025 Ultra Librarian. All rights reserved.; Manufacturer_Part_Number: LM3150MHE/NOPB; Datasheet: https://www.ti.com/lit/gpn/lm3150; RefDes: RefDes; Type: Type

## Sheet 3V3_Buck.SchDoc
size A; SheetNumber: 9; SheetTotal: 17
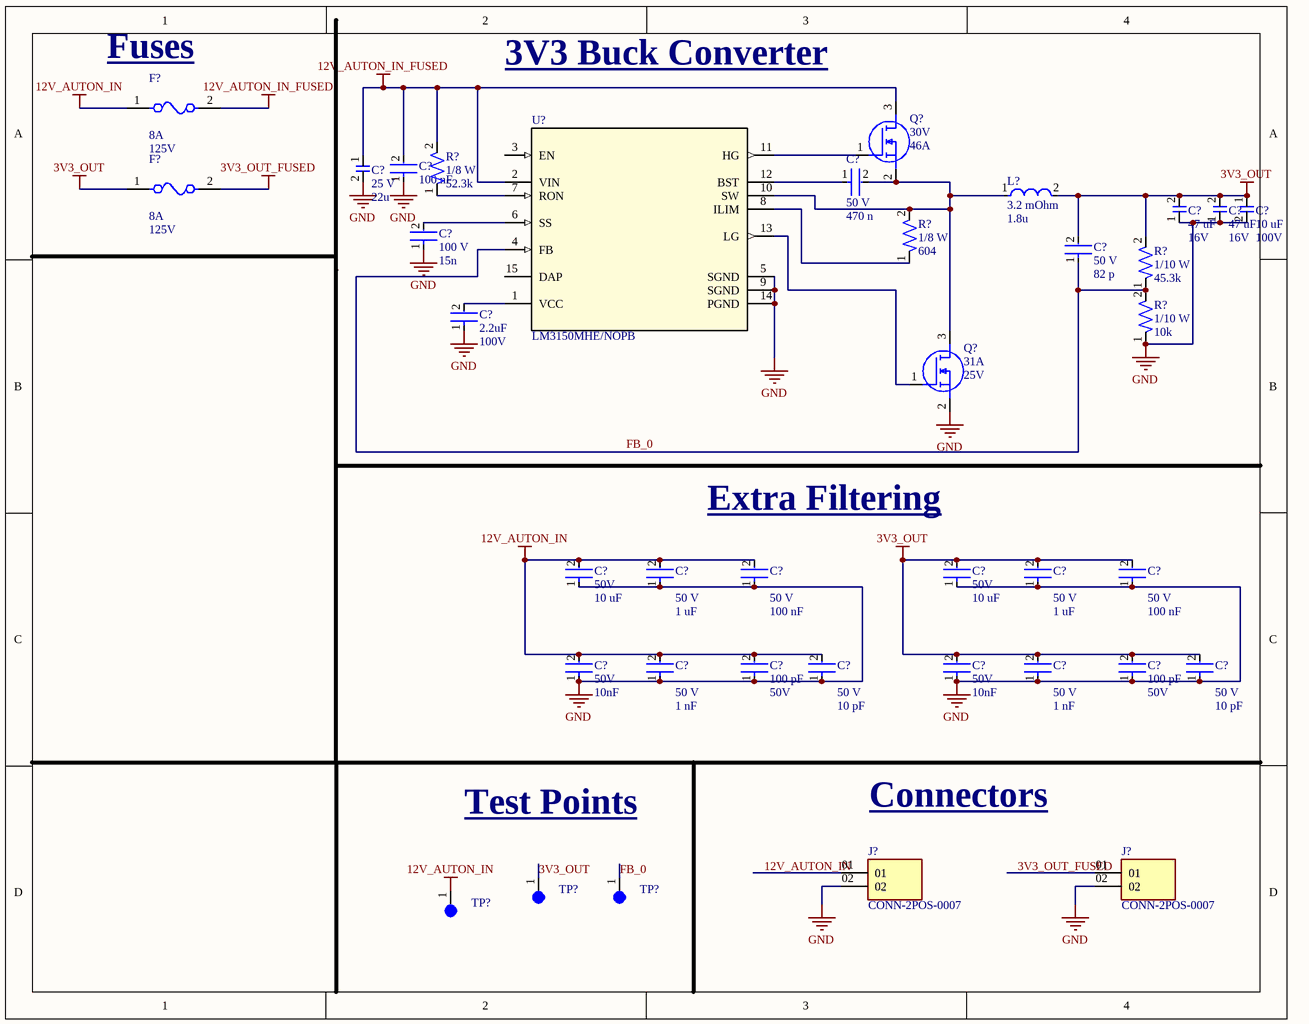
[diagram p4: 3V3_Buck.SchDoc]

### Parts
(Parts that share a designator on the sheet are numbered #1, #2 ... from top to bottom, then left to right.)
C?#67  Voltage: 25 V  Capacitance: 22u  [CAP-1210]  (hidden comment: CL32A226MAJNNNE)
C?#68  Capacitance: 100 nF  [CAP-0603]  (hidden comment: GMC10X7S104K100NT)
C?#69  Voltage: 50 V  Capacitance: 470 n  [CAP-0805]  (hidden comment: CC0805ZRY5V9BB474)
C?#70  Capacitance: 47 uF  Voltage: 16V  [CAP-1210]  (hidden comment: GRM32ER61C476KE15L)
C?#71  Capacitance: 47 uF  Voltage: 16V  [CAP-1210]  (hidden comment: GRM32ER61C476KE15L)
C?#72  Capcitance: 10 uF  Voltage Rating: 100V  [CAP-1210]  (hidden comment: GRM32EC72A106KE05L)
C?#73  Voltage: 100 V  Capacitance: 15n  [CAP-0805]  (hidden comment: CC0805KRX7R0BB153)
C?#74  Voltage: 50 V  Capacitance: 82 p  [CAP-0402]  (hidden comment: CC0402FRNPO9BN820)
C?#75  Capacitance: 2.2uF  Voltage: 100V  [CAP-1206]  (hidden comment: CC1206KKX7R0BB225)
C?#76  Voltage: 50 V  Capacitance: 1 uF  [CAP-0805]  (hidden comment: CC0805KKX7R9BB105)
C?#77  Voltage: 50 V  Capacitance: 100 nF  [CAP-0805]  (hidden comment: CC0805KRX7R9BB104)
C?#78  Voltage: 50 V  Capacitance: 1 uF  [CAP-0805]  (hidden comment: CC0805KKX7R9BB105)
C?#79  Voltage: 50 V  Capacitance: 100 nF  [CAP-0805]  (hidden comment: CC0805KRX7R9BB104)
C?#80  Voltage: 50V  Capacitance: 10 uF  [CAP-1210]  (hidden comment: CL32B106KBJNNNE)
C?#81  Voltage: 50V  Capacitance: 10 uF  [CAP-1210]  (hidden comment: CL32B106KBJNNNE)
C?#82  Voltage: 50 V  Capacitance: 1 nF  [CAP-0402]  (hidden comment: CC0402KRX7R9BB102)
C?#83  Voltage: 50 V  Capacitance: 10 pF  [CAP-0402]  (hidden comment: CC0402JRNPO9BN100)
C?#84  Voltage: 50 V  Capacitance: 1 nF  [CAP-0402]  (hidden comment: CC0402KRX7R9BB102)
C?#85  Voltage: 50 V  Capacitance: 10 pF  [CAP-0402]  (hidden comment: CC0402JRNPO9BN100)
C?#86  Voltage: 50V  Capacitance: 10nF  [CAP-0805]  (hidden comment: GRM2195C1H103JA01D)
C?#87  Capacitance: 100 pF  Voltage: 50V  [CAP-0402]  (hidden comment: CC0402JRNPO9BN101)
C?#88  Voltage: 50V  Capacitance: 10nF  [CAP-0805]  (hidden comment: GRM2195C1H103JA01D)
C?#89  Capacitance: 100 pF  Voltage: 50V  [CAP-0402]  (hidden comment: CC0402JRNPO9BN101)
F?#7  Fuse Current: 8A  Voltage Rating: 125V  [FUSE-0001]  (hidden comment: 01550900M)
F?#8  Fuse Current: 8A  Voltage Rating: 125V  [FUSE-0001]  (hidden comment: 01550900M)
J?#8  CONN-2POS-0007  [SAMTEC_HFWJ-02-02-T-S]
J?#9  CONN-2POS-0007  [SAMTEC_HFWJ-02-02-T-S]
L?#4  Resistance: 3.2 mOhm  Inductance: 1.8u  (hidden comment: XGL1060-182MEC)
Q?#8  Max Voltage: 30V  Max Current: 46A  [NTMFS5C670NLT1G_ONS - duplicate]  (hidden comment: NTMFS4C029NT1G)
Q?#9  Max Current: 31A  Max Voltage: 25V  (hidden comment: CSD16321Q5)
R?#16  Power: 1/8 W  Resistance: 52.3k  [RES-0402]  (hidden comment: AC0402FR-7W52K3L)
R?#17  Power: 1/8 W  Resistance: 604  [RES-0805]  (hidden comment: RC0805FR-07590RL)
R?#18  Power: 1/10 W  Resistance: 45.3k  [RES-0603]  (hidden comment: RC0603FR-0745K3L)
R?#19  Power: 1/10 W  Resistance: 10k  [CAP-0603]  (hidden comment: RC0603FR-0710KL)
TP?#11  5003  [TEST-POINT-0001]  (value not drawn)
TP?#12  5003  [TEST-POINT-0001]  (value not drawn)
TP?#13  5003  [TEST-POINT-0001]  (value not drawn)
U?#4  LM3150MHE/NOPB  [MXA14A]

### Nets
3V3_OUT: C?#70.2 C?#71.2 C?#72.1 C?#74.2 C?#78.2 C?#79.2 C?#81.2 C?#84.2 C?#85.2 C?#88.2 C?#89.2 F?#8.1 L?#4.2 R?#18.2 TP?#11.1
3V3_OUT_FUSED: F?#8.2
12V_AUTON_IN: C?#76.2 C?#77.2 C?#80.2 C?#82.2 C?#83.2 C?#86.2 C?#87.2 F?#7.1 TP?#13.1
12V_AUTON_IN_FUSED: C?#67.1 C?#68.2 F?#7.2 Q?#8.3(D) R?#16.2 U?#4.2(VIN)
GND: C?#67.2 C?#68.1 C?#70.1 C?#71.1 C?#72.2 C?#73.1 C?#75.1 C?#76.1 C?#77.1 C?#78.1 C?#79.1 C?#80.1 C?#81.1 C?#82.1 C?#83.1 C?#84.1 C?#85.1 C?#86.1 C?#87.1 C?#88.1 C?#89.1 J?#8.02 J?#9.02 Q?#9.2(S) R?#19.1 U?#4.5(SGND) U?#4.9(SGND) U?#4.14(PGND)
FB_0: C?#74.1 R?#18.1 R?#19.2 TP?#12.1 U?#4.4(FB)
NetC?#69_1: C?#69.1 U?#4.12(BST)
NetC?#69_2: C?#69.2 L?#4.1 Q?#8.2(S) Q?#9.3(D) R?#17.2 U?#4.10(SW)
NetC?#73_2: C?#73.2 U?#4.6(SS)
NetC?#75_2: C?#75.2 U?#4.1(VCC)
NetQ?#8_1: Q?#8.1(G) U?#4.11(HG)
NetQ?#9_1: Q?#9.1(G) U?#4.13(LG)
NetR?#16_1: R?#16.1 U?#4.7(RON)
NetR?#17_1: R?#17.1 U?#4.8(ILIM)

Not connected (* = marked no-connect by the designer): J?#8 01; J?#9 01; U?#4 3(EN) 15(DAP)

### Notes on the sheet
- (near F?#7) Fuses
- 3V3 Buck Converter
- (near C?#77) Extra Filtering
- Test Points
- Connectors
- Labels drawn without touching a wire or pin: 3V3_OUT_FUSED, 12V_AUTON_IN

### Library data of the parts
C?#67 = CAP-22u-0005: 22 µF ±20% 25V Ceramic Capacitor X5R 1210 (3225 Metric)
C?#68 = CAP-100N-0001: as C?#1 on sheet 24V_Buck_LA
C?#69 = CAP-470N-0002: as C?#3 on sheet 24V_Buck_LA
C?#70 C?#71 = CAP-47U-0001: as C?#47 on sheet 5V_Buck; Manufacturer Part Number: GRM32ER61C476KE15L; Package Size: 1210
C?#72 = CAP-10U-0003: as C?#49 on sheet 5V_Buck; Package Size: 1210
C?#73 = CAP-15N-0001: as C?#4 on sheet 24V_Buck_LA
C?#74 = CAP-82P-0002: 82 pF ±1% 50V Ceramic Capacitor C0G, NP0 0402 (1005 Metric)
C?#75 = CAP-2.2U-0001: CAP CER 2.2UF 100V X7R 1206; Device Class: Ceramic; Size: 1206; ComponentLink1Description: Datasheet; ComponentLink1URL: https://www.yageo.com/upload/media/product/productsearch/datasheet/mlcc/UPY-GPHC_X7R_6.3V-to-250V_24.pdf
C?#76 C?#78 = CAP-1U-0001: as C?#7 on sheet 24V_Buck_LA
C?#77 C?#79 = CAP-100N-0002: as C?#8 on sheet 24V_Buck_LA
C?#80 C?#81 = CAP-10U-0002: CAP CER 10UF 50V X7R 1210; Device Class: Ceramic; Size: 1210; ComponentLink1Description: Datasheet; ComponentLink1URL: https://mm.digikey.com/Volume0/opasdata/d220001/medias/docus/41/CL32B106KBJNNNE_Spec.pdf
C?#82 C?#84 = CAP-1N-0001: as C?#13 on sheet 24V_Buck_LA
C?#83 C?#85 = CAP-10P-0001: as C?#14 on sheet 24V_Buck_LA
C?#86 C?#88 = CAP-10N-0001: CAP CER 10000PF 50V C0G/NP0 0805; Device Class: Ceramic; Size: 0805; ComponentLink1Description: Datasheet; ComponentLink1URL: https://search.murata.co.jp/Ceramy/image/img/A01X/G101/ENG/GRM2195C1H103JA01-01.pdf
C?#87 C?#89 = CAP-100P-0001: CAP CER 100PF 50V C0G/NPO 0402; Device Class: Ceramic; Size: 0402; ComponentLink1Description: Datasheet; ComponentLink1URL: https://www.yageo.com/upload/media/product/productsearch/datasheet/mlcc/UPY-GP_NP0_16V-to-50V_18.pdf
F?#7 F?#8 = FUSE-0001: FUSE BLOK CARTRIDGE 125V 10A SMD; ComponentLink2Description: Datasheet; ComponentLink2URL: https://www.littelfuse.com/~/media/electronics/datasheets/fuses/littelfuse_fuse_154_154t_154l_154tl_datasheet.pdf.pdf
J?#8 J?#9 = CONN-2POS-0007: as J?#2 on sheet 24V_Buck_LA; SnapEDA_Link: https://www.snapeda.com/parts/HFWJ-02-02-T-S/Samtec/view-part/?ref=snap; Package: None; Value: *; Check_prices: https://www.snapeda.com/parts/HFWJ-02-02-T-S/Samtec/view-part/?ref=eda
L?#4 = IND-1.8u-0001: 1.8 µH Shielded Molded Inductor 28.2 A 3.2mOhm Max Nonstandard
Q?#8 = NMOS-46A-0001: as Q?#6 on sheet 5V_Buck
Q?#9 = NMOS-31A-0001: as Q?#7 on sheet 5V_Buck
R?#16 = RES-52.3k-0001: 52.3 kOhms ±1% 0.125W, 1/8W Chip Resistor 0402 (1005 Metric) Automotive AEC-Q200, Moisture Resistant Thick Film
R?#17 = RES-604-0001: 590 Ohms ±1% 0.125W, 1/8W Chip Resistor 0805 (2012 Metric) Moisture Resistant Thick Film
R?#18 = RES-45.3k-0001: 45.3 kOhms ±1% 0.1W, 1/10W Chip Resistor 0603 (1608 Metric) Moisture Resistant Thick Film
R?#19 = RES-10k-0002: as R?#4 on sheet 24V_Buck_LA
TP?#11-TP?#13 = TEST-POINT-0001: as TP?#1 on sheet 24V_Buck_LA
U?#4 = IC-BUCK_0011: as U?#2 on sheet 18V_Jetson; Copyright: Copyright (C) 2025 Ultra Librarian. All rights reserved.; Manufacturer_Part_Number: LM3150MHE/NOPB; Datasheet: https://www.ti.com/lit/gpn/lm3150; RefDes: RefDes; Type: Type

## Sheet 12V_Auton.SchDoc
size A; SheetNumber: 4; SheetTotal: 16
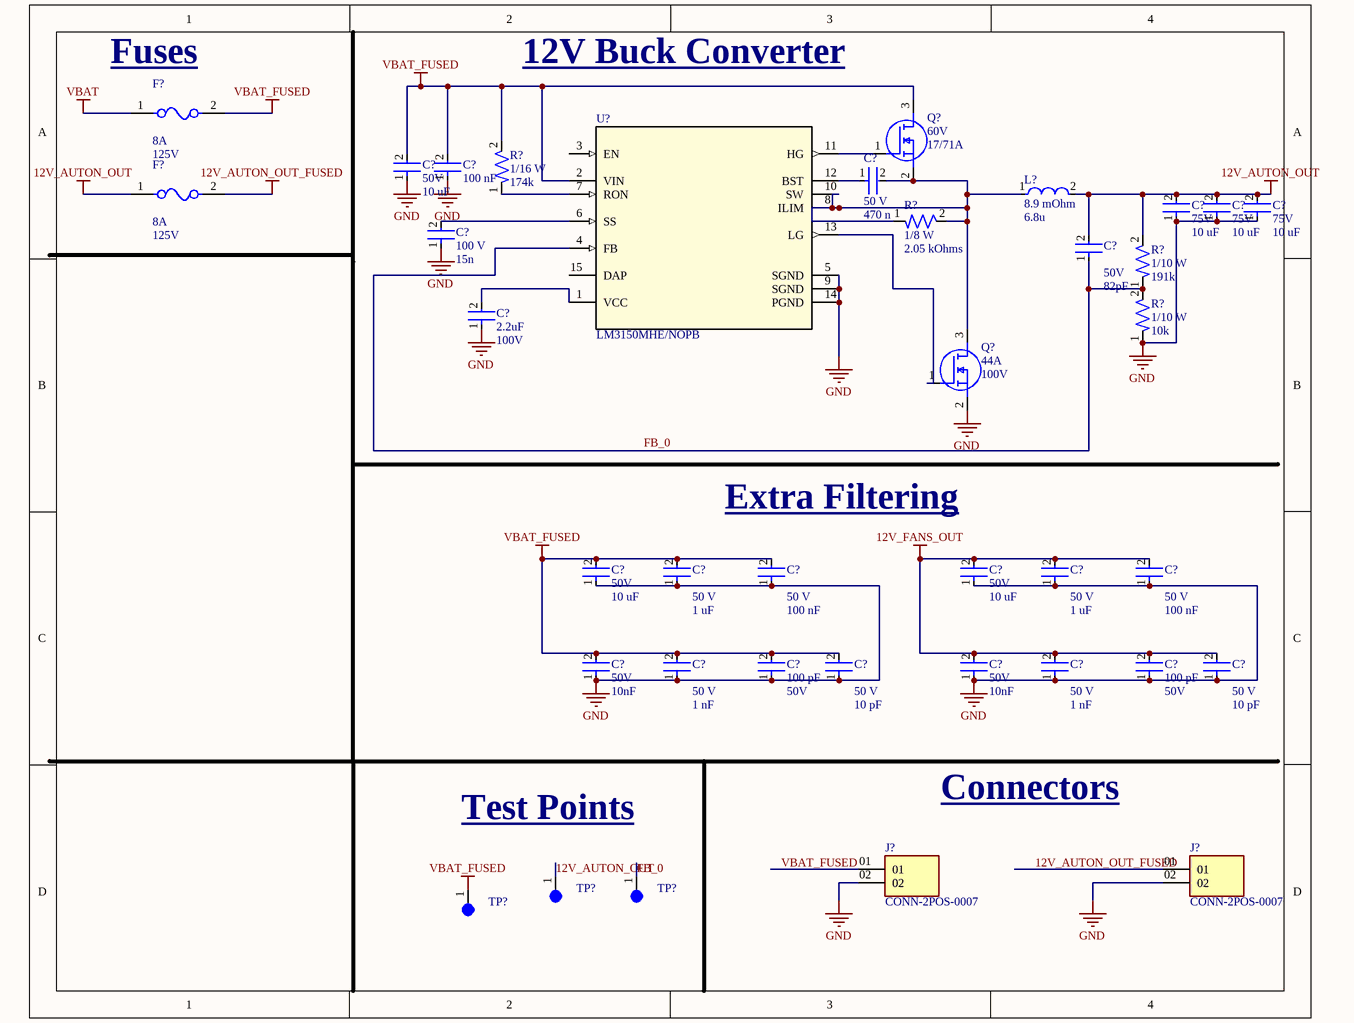
[diagram p5: 12V_Auton.SchDoc]

### Parts
(Parts that share a designator on the sheet are numbered #1, #2 ... from top to bottom, then left to right.)
C?#90  Capacitance: 100 nF  [CAP-0603]  (hidden comment: GMC10X7S104K100NT)
C?#91  Voltage: 50V  Capacitance: 10 uF  [CAP-1210]  (hidden comment: CL32B106KBJNNNE)
C?#92  Voltage: 50 V  Capacitance: 470 n  [CAP-0805]  (hidden comment: CC0805ZRY5V9BB474)
C?#93  Voltage: 75V  Capacitance: 10 uF  [CAP-1210-0001]  (hidden comment: C3225X7R1N106K250AC)
C?#94  Voltage: 75V  Capacitance: 10 uF  [CAP-1210-0001]  (hidden comment: C3225X7R1N106K250AC)
C?#95  Voltage: 75V  Capacitance: 10 uF  [CAP-1210-0001]  (hidden comment: C3225X7R1N106K250AC)
C?#96  Voltage: 100 V  Capacitance: 15n  [CAP-0805]  (hidden comment: CC0805KRX7R0BB153)
C?#97  Voltage: 50V  Capacitance: 82pF  [CAP-0805]  (hidden comment: CC0805JRNPO9BN820)
C?#98  Capacitance: 2.2uF  Voltage: 100V  [CAP-1206]  (hidden comment: CC1206KKX7R0BB225)
C?#99  Voltage: 50 V  Capacitance: 1 uF  [CAP-0805]  (hidden comment: CC0805KKX7R9BB105)
C?#100  Voltage: 50 V  Capacitance: 100 nF  [CAP-0805]  (hidden comment: CC0805KRX7R9BB104)
C?#101  Voltage: 50 V  Capacitance: 1 uF  [CAP-0805]  (hidden comment: CC0805KKX7R9BB105)
C?#102  Voltage: 50 V  Capacitance: 100 nF  [CAP-0805]  (hidden comment: CC0805KRX7R9BB104)
C?#103  Voltage: 50V  Capacitance: 10 uF  [CAP-1210]  (hidden comment: CL32B106KBJNNNE)
C?#104  Voltage: 50V  Capacitance: 10 uF  [CAP-1210]  (hidden comment: CL32B106KBJNNNE)
C?#105  Voltage: 50 V  Capacitance: 1 nF  [CAP-0402]  (hidden comment: CC0402KRX7R9BB102)
C?#106  Voltage: 50 V  Capacitance: 10 pF  [CAP-0402]  (hidden comment: CC0402JRNPO9BN100)
C?#107  Voltage: 50 V  Capacitance: 1 nF  [CAP-0402]  (hidden comment: CC0402KRX7R9BB102)
C?#108  Voltage: 50 V  Capacitance: 10 pF  [CAP-0402]  (hidden comment: CC0402JRNPO9BN100)
C?#109  Voltage: 50V  Capacitance: 10nF  [CAP-0805]  (hidden comment: GRM2195C1H103JA01D)
C?#110  Capacitance: 100 pF  Voltage: 50V  [CAP-0402]  (hidden comment: CC0402JRNPO9BN101)
C?#111  Voltage: 50V  Capacitance: 10nF  [CAP-0805]  (hidden comment: GRM2195C1H103JA01D)
C?#112  Capacitance: 100 pF  Voltage: 50V  [CAP-0402]  (hidden comment: CC0402JRNPO9BN101)
F?#9  Fuse Current: 8A  Voltage Rating: 125V  [FUSE-0001]  (hidden comment: 01550900M)
F?#10  Fuse Current: 8A  Voltage Rating: 125V  [FUSE-0001]  (hidden comment: 01550900M)
J?#10  CONN-2POS-0007  [SAMTEC_HFWJ-02-02-T-S]
J?#11  CONN-2POS-0007  [SAMTEC_HFWJ-02-02-T-S]
L?#5  Resistance: 8.9 mOhm  Inductance: 6.8u  (hidden comment: XAL1010-682MED)
Q?#10  Vdss: 60V  Current: 17/71A  [NTMFS5C670NLT1G_ONS]  (hidden comment: NTMFS5C670NLT1G)
Q?#11  Current: 44A  Vdss: 100V  [TRANS_CSD19534Q5A]  (hidden comment: CSD19534Q5A)
R?#20  Power: 1/16 W  Resistance: 174k  [RES-0402]  (hidden comment: RC0402FR-07174KL)
R?#21  Power: 1/8 W  Resistance: 2.05 kOhms  [RES-0805]  (hidden comment: RC0805FR-072K05L)
R?#22  Power: 1/10 W  Resistance: 191k  [RES-0603]  (hidden comment: AC0603FR-07191KL)
R?#23  Power: 1/10 W  Resistance: 10k  [CAP-0603]  (hidden comment: RC0603FR-0710KL)
TP?#14  5003  [TEST-POINT-0001]  (value not drawn)
TP?#15  5003  [TEST-POINT-0001]  (value not drawn)
TP?#16  5003  [TEST-POINT-0001]  (value not drawn)
U?#5  LM3150MHE/NOPB  [MXA14A]

### Nets
12V_AUTON_OUT: C?#93.2 C?#94.2 C?#95.2 C?#97.2 F?#10.1 L?#5.2 R?#22.2 TP?#14.1
12V_AUTON_OUT_FUSED: F?#10.2
12V_FANS_OUT: C?#101.2 C?#102.2 C?#104.2 C?#107.2 C?#108.2 C?#111.2 C?#112.2
GND: C?#90.1 C?#91.1 C?#93.1 C?#94.1 C?#95.1 C?#96.1 C?#98.1 C?#99.1 C?#100.1 C?#101.1 C?#102.1 C?#103.1 C?#104.1 C?#105.1 C?#106.1 C?#107.1 C?#108.1 C?#109.1 C?#110.1 C?#111.1 C?#112.1 J?#10.02 J?#11.02 Q?#11.2(S) R?#23.1 U?#5.5(SGND) U?#5.9(SGND) U?#5.14(PGND)
VBAT: F?#9.1
VBAT_FUSED: C?#90.2 C?#91.2 C?#99.2 C?#100.2 C?#103.2 C?#105.2 C?#106.2 C?#109.2 C?#110.2 F?#9.2 Q?#10.3(D) R?#20.2 TP?#16.1 U?#5.2(VIN)
FB_0: C?#97.1 R?#22.1 R?#23.2 TP?#15.1 U?#5.4(FB)
NetC?#92_1: C?#92.1 U?#5.12(BST)
NetC?#92_2: C?#92.2 L?#5.1 Q?#10.2(S) Q?#11.3(D) R?#21.1 R?#21.2 U?#5.8(ILIM) U?#5.10(SW)
NetC?#96_2: C?#96.2 U?#5.6(SS)
NetC?#98_2: C?#98.2 U?#5.1(VCC)
NetQ?#10_1: Q?#10.1(G) U?#5.11(HG)
NetQ?#11_1: Q?#11.1(G) U?#5.13(LG)
NetR?#20_1: R?#20.1 U?#5.7(RON)

Not connected (* = marked no-connect by the designer): J?#10 01; J?#11 01; U?#5 3(EN) 15(DAP)

### Notes on the sheet
- (near F?#9) Fuses
- 12V Buck Converter
- (near C?#100) Extra Filtering
- Test Points
- Connectors
- Labels drawn without touching a wire or pin: 12V_AUTON_OUT_FUSED, VBAT_FUSED

### Library data of the parts
C?#90 = CAP-100N-0001: as C?#1 on sheet 24V_Buck_LA
C?#91 C?#103 C?#104 = CAP-10U-0002: CAP CER 10UF 50V X7R 1210; Device Class: Ceramic; Size: 1210; ComponentLink1Description: Datasheet; ComponentLink1URL: https://mm.digikey.com/Volume0/opasdata/d220001/medias/docus/41/CL32B106KBJNNNE_Spec.pdf
C?#92 = CAP-470N-0002: as C?#3 on sheet 24V_Buck_LA
C?#93-C?#95 = CAP-10U-0003: CAP CER 10UF 75V X7R 1210; Device Class: Ceramic; Size: 1210; ComponentLink1Description: Datasheet; ComponentLink1URL: https://mm.digikey.com/Volume0/opasdata/d220001/medias/docus/41/CL32B106KBJNNNE_Spec.pdf
C?#96 = CAP-15N-0001: as C?#4 on sheet 24V_Buck_LA
C?#97 = CAP-82P-0001: 82 pF ±5% 50V Ceramic Capacitor C0G, NP0 0805 (2012 Metric)
C?#98 = CAP-2.2U-0001: CAP CER 2.2UF 100V X7R 1206; Device Class: Ceramic; Size: 1206; ComponentLink1Description: Datasheet; ComponentLink1URL: https://www.yageo.com/upload/media/product/productsearch/datasheet/mlcc/UPY-GPHC_X7R_6.3V-to-250V_24.pdf
C?#99 C?#101 = CAP-1U-0001: as C?#7 on sheet 24V_Buck_LA
C?#100 C?#102 = CAP-100N-0002: as C?#8 on sheet 24V_Buck_LA
C?#105 C?#107 = CAP-1N-0001: as C?#13 on sheet 24V_Buck_LA
C?#106 C?#108 = CAP-10P-0001: as C?#14 on sheet 24V_Buck_LA
C?#109 C?#111 = CAP-10N-0001: CAP CER 10000PF 50V C0G/NP0 0805; Device Class: Ceramic; Size: 0805; ComponentLink1Description: Datasheet; ComponentLink1URL: https://search.murata.co.jp/Ceramy/image/img/A01X/G101/ENG/GRM2195C1H103JA01-01.pdf
C?#110 C?#112 = CAP-100P-0001: CAP CER 100PF 50V C0G/NPO 0402; Device Class: Ceramic; Size: 0402; ComponentLink1Description: Datasheet; ComponentLink1URL: https://www.yageo.com/upload/media/product/productsearch/datasheet/mlcc/UPY-GP_NP0_16V-to-50V_18.pdf
F?#9 F?#10 = FUSE-0001: FUSE BLOK CARTRIDGE 125V 10A SMD; ComponentLink2Description: Datasheet; ComponentLink2URL: https://www.littelfuse.com/~/media/electronics/datasheets/fuses/littelfuse_fuse_154_154t_154l_154tl_datasheet.pdf.pdf
J?#10 J?#11 = CONN-2POS-0007: as J?#2 on sheet 24V_Buck_LA; SnapEDA_Link: https://www.snapeda.com/parts/HFWJ-02-02-T-S/Samtec/view-part/?ref=snap; Package: None; Value: *; Check_prices: https://www.snapeda.com/parts/HFWJ-02-02-T-S/Samtec/view-part/?ref=eda
L?#5 = IND-6.8u-0001: as L?#2 on sheet 18V_Jetson
Q?#10 = MOS-17/71A-0001: MOSFET N-CH 60V 17A/71A 5DFN; Manufacturer_Name: onsemi; Vth: 2V; Copyright: Copyright (C) 2025 Ultra Librarian. All rights reserved.; Manufacturer_Part_Number: NTMFS5C670NLT1G; RefDes: RefDes; Type: Type
Q?#11 = MOS-44A-0001: as Q?#5 on sheet 18V_Jetson; Mouser-Purchase-URL: https://snapeda.com/shop?store=Mouser&id=485742; Package: VSONP-8 Texas Instruments; Texas_Instruments-Purchase-URL: https://snapeda.com/shop?store=Texas+Instruments&id=485742; Value: *; Price: None; DigiKey-Purchase-URL: https://snapeda.com/shop?store=DigiKey&id=485742; MP: CSD19534Q5A; SnapEDA_Link: https://www.snapeda.com/parts/CSD19534Q5A/Texas%20Instruments/view-part/485742/?ref=snap; Availability: Good
R?#20 = RES-174K-0001: RES 174K OHM 1% 1/16W 0402
R?#21 = RES-2.05k-0001: 2.05 kOhms ±1% 0.125W, 1/8W Chip Resistor 0805 (2012 Metric) Moisture Resistant Thick Film
R?#22 = RES-191K-001: 191 kOhms ±1% 0.1W, 1/10W Chip Resistor 0603 (1608 Metric) Automotive AEC-Q200, Moisture Resistant Thick Film
R?#23 = RES-10k-0002: as R?#4 on sheet 24V_Buck_LA
TP?#14-TP?#16 = TEST-POINT-0001: as TP?#1 on sheet 24V_Buck_LA
U?#5 = IC-BUCK_0011: as U?#2 on sheet 18V_Jetson; Copyright: Copyright (C) 2025 Ultra Librarian. All rights reserved.; Manufacturer_Part_Number: LM3150MHE/NOPB; Datasheet: https://www.ti.com/lit/gpn/lm3150; RefDes: RefDes; Type: Type